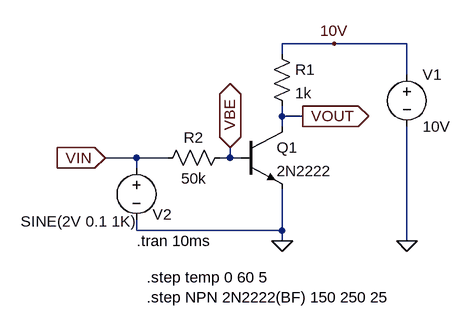
[diagram p0: schematic npn-essai1.asc]
npn-essai1.asc, the LTspice schematic file:
Version 4
SHEET 1 880 680
WIRE 176 112 96 112
WIRE 288 112 176 112
WIRE 96 128 96 112
WIRE 288 160 288 112
WIRE 96 224 96 208
WIRE 128 224 96 224
WIRE 96 240 96 224
WIRE -128 288 -176 288
WIRE -80 288 -128 288
WIRE 16 288 16 272
WIRE 16 288 0 288
WIRE 32 288 16 288
WIRE -128 304 -128 288
WIRE -128 400 -128 384
WIRE 96 400 96 336
WIRE 96 400 -128 400
WIRE 96 416 96 400
WIRE 288 416 288 240
FLAG 96 416 0
FLAG 288 416 0
FLAG 128 224 VOUT
IOPIN 128 224 Out
FLAG -176 288 VIN
IOPIN -176 288 In
FLAG 16 272 VBE
IOPIN 16 272 BiDir
FLAG 176 112 10V
SYMBOL res 80 112 R0
SYMATTR InstName R1
SYMATTR Value 1k
SYMBOL voltage 288 144 R0
WINDOW 123 0 0 Left 0
WINDOW 39 0 0 Left 0
SYMATTR InstName V1
SYMATTR Value 10V
SYMBOL voltage -128 288 R0
WINDOW 3 -178 98 Left 0
WINDOW 123 0 0 Left 0
WINDOW 39 0 0 Left 0
WINDOW 0 25 87 Left 0
SYMATTR Value SINE(2V 0.1 1K)
SYMATTR InstName V2
SYMBOL res 16 272 R90
WINDOW 0 0 56 VBottom 0
WINDOW 3 32 56 VTop 0
SYMATTR InstName R2
SYMATTR Value 50k
SYMBOL npn 32 240 R0
SYMATTR InstName Q1
SYMATTR Value 2N2222
TEXT -128 416 Left 0 !.tran 10ms
TEXT -112 472 Left 0 !.step temp 0 60 5\n.step NPN 2N2222(BF) 150 250 25

The netlist it stands for:
* npn-essai1.asc
R1 10V VOUT 1k
V1 10V 0 10V
V2 VIN 0 SINE(2V 0.1 1K)
R2 VBE VIN 50k
Q1 VOUT VBE 0 0 2N2222
.model NPN NPN
.model PNP PNP
.lib standard.bjt
.tran 10ms
.step temp 0 60 5
.step NPN 2N2222(BF) 150 250 25
.backanno
.end